# Altium project ControllerV3.0.PrjPcb
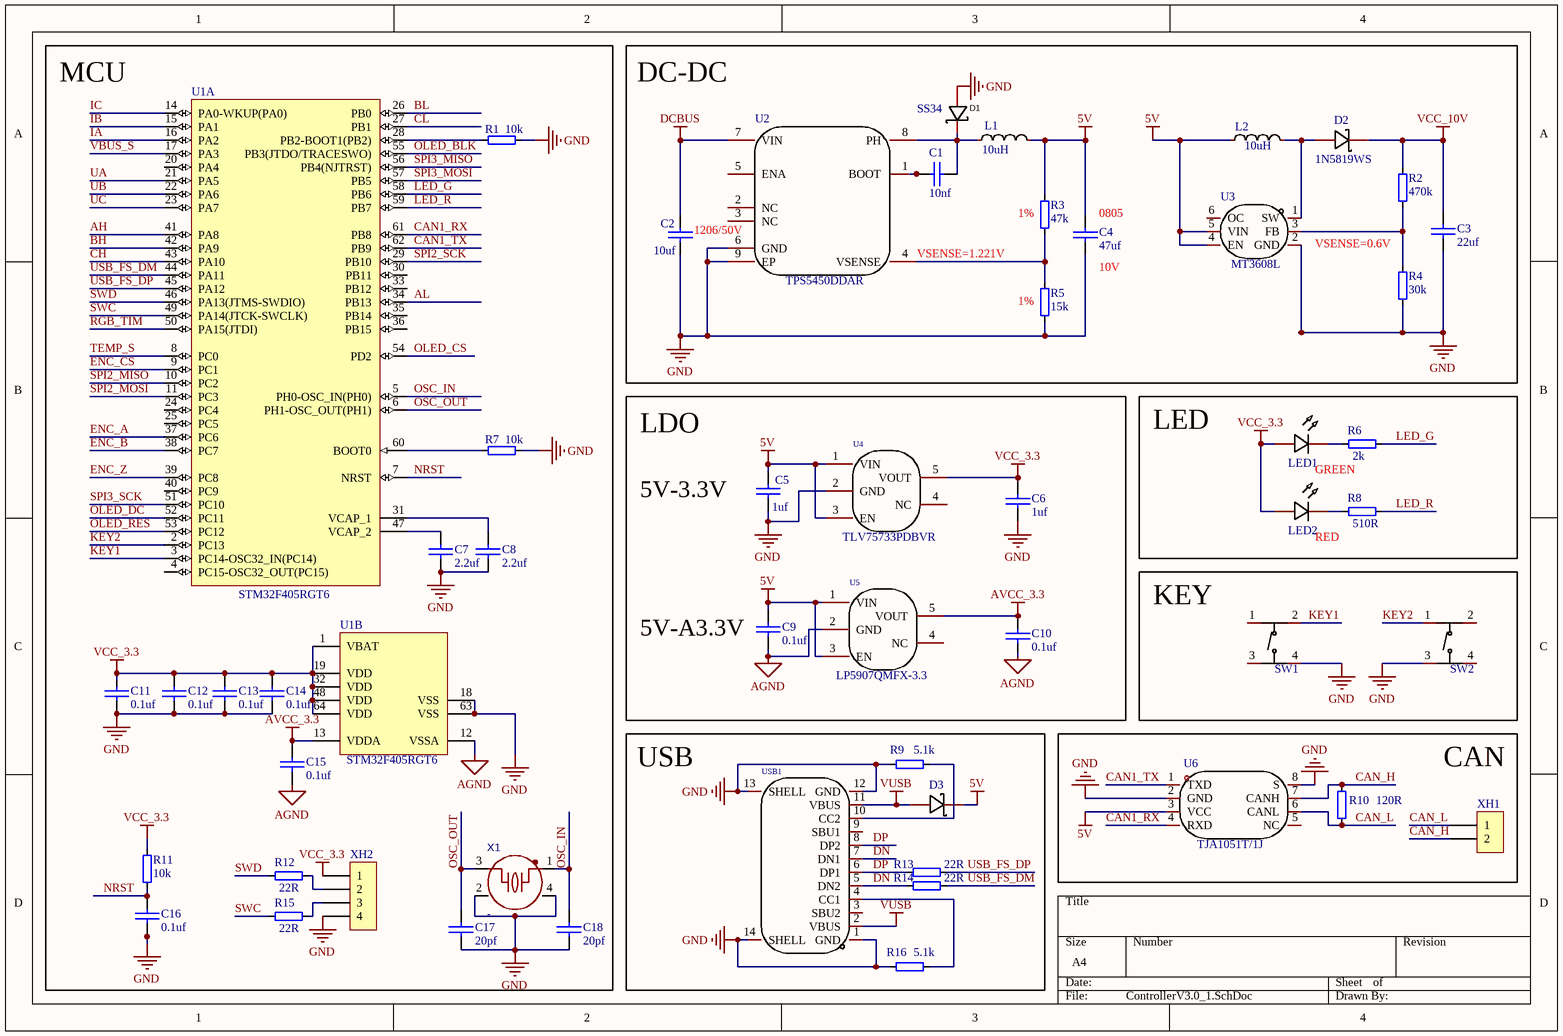
[diagram p0: ControllerV3.0_1.SchDoc]
2 sheets, 96 parts. Net scope: global (net labels, ports and power ports of the same name join across sheets).
Board file: ControllerV3.0.PcbDoc
Sheets:
  ControllerV3.0_1.SchDoc
  ControllerV3.0_2.SchDoc

## Sheet ControllerV3.0_1.SchDoc
size A4; SheetNumber: 1; SheetTotal: 2

### Parts
C1  10nf  [C0603_S]
C2  10uf  [C1206_S]
C3  22uf  [C0603_S]
C4  47uf  [C0805_S]
C5  1uf  [C0603_S]
C6  1uf  [C0603_S]
C7  2.2uf  [C0603_S]
C8  2.2uf  [C0603_S]
C9  0.1uf  [C0603_S]
C10  0.1uf  [C0603_S]
C11  0.1uf  [C0603_S]
C12  0.1uf  [C0603_S]
C13  0.1uf  [C0603_S]
C14  0.1uf  [C0603_S]
C15  0.1uf  [C0603_S]
C16  0.1uf  [C0603_S]
C17  20pf  [C0603_S]
C18  20pf  [C0603_S]
D1  SS34  [SS34]
D2  1N5819WS  [SOD-323]
D3  1N5819WS  [SOD-323]  (value not drawn)
L1  10uH  [SMD-0420]
L2  10uH  [IND-SMD_L3.0-W3.0_SWPA3010S]
LED1  LED_0603-B  [LED_0603]  (value not drawn)
LED2  LED_0603-B  [LED_0603]  (value not drawn)
R1  10k  [R0603_S]
R2  470k  [R0603_S]
R3  47k  [R0603_S]
R4  30k  [R0603_S]
R5  15k  [R0603_S]
R6  2k  [R0603_S]
R7  10k  [R0603_S]
R8  510R  [R0603_S]
R9  5.1k  [R0603_S]
R10  120R  [R0603_S]
R11  10k  [R0603_S]
R12  22R  [R0603_S]
R13  22R  [R0603_S]
R14  22R  [R0603_S]
R15  22R  [R0603_S]
R16  5.1k  [R0603_S]
SW1  TS-1187A-B-A-B  [TSW SMD-4*4*1.5]  (value not drawn)
SW2  TS-1187A-B-A-B  [TSW SMD-4*4*1.5]  (value not drawn)
U1  STM32F405RGT6  [LQFP_64]  (parts A,B of 2)
U2  TPS5450DDAR  [SOP-8-EP]
U3  MT3608L  [SOT-23-6]
U4  TLV75733PDBVR  [SOT-23-5]
U5  LP5907QMFX-3.3  [SOT-23-5]
U6  TJA1051T/1J  [SOP-8]
USB1  TYPE-C 16PIN 2MD(073)  [USB-C-SMD_TYPE-C-6PIN-2MD-073]  (value not drawn)
X1  -  [OSC 3225-4P]
XH1  XH2.54-WS-2P  [XH2.54-WS-2P]  (value not drawn)
XH2  GH1.25-WS-4P  [GH1.25-WS-4P]  (value not drawn)

### Blocks framed on the sheet
MCU: C7 C8 C11-C18 R1 R7 R11 R12 R15 U1 X1 XH2
DC-DC: C1-C4 D1 D2 L1 L2 R2-R5 U2 U3
LDO: C5 C6 C9 C10 U4 U5
LED: LED1 LED2 R6 R8
KEY: SW1 SW2
USB: D3 R9 R13 R14 R16 USB1
CAN: R10 U6 XH1

### Nets
5V: C4.1 C5.1 C9.1 D3.1(K) L1.2 L2.1 R3.2 U3.4(EN) U3.5(VIN) U4.1(VIN) U4.3(EN) U5.1(VIN) U5.3(EN) U6.3(VCC)
AGND: C9.2 C10.2 C15.2 U1.12(VSSA) U5.2(GND)
AVCC_3.3: C10.1 C15.1 U1.13(VDDA) U5.5(VOUT)
DCBUS: C2.1 U2.7(VIN)
GND: C2.2 C3.1 C4.2 C5.2 C6.2 C7.2 C8.2 C11.2 C12.2 C13.2 C14.2 C16.1 C17.2 C18.2 D1.2(A) R1.2 R4.1 R5.1 R7.2 R9.1 R16.1 SW1.4(D) SW2.3(C) U1.18(VSS) U1.63(VSS) U2.6(GND) U2.9(EP) U3.2(GND) U4.2(GND) U6.2(GND) U6.8(S) USB1.1(GND) USB1.12(GND) USB1.13(SHELL) USB1.14(SHELL) X1.2(GND) X1.4(GND) XH2.4
VCC_3.3: C6.1 C11.1 C12.1 C13.1 C14.1 LED1.2(A) LED2.2(A) R11.2 U1.1(VBAT) U1.19(VDD) U1.32(VDD) U1.48(VDD) U1.64(VDD) U4.5(VOUT) XH2.1
VCC_10V: C3.2 D2.1(K) R2.2
VUSB: D3.2(A) USB1.2(VBUS) USB1.11(VBUS)
AH: U1.41(PA8)
AL: U1.34(PB13)
BH: U1.42(PA9)
BL: U1.26(PB0)
CAN1_RX: U1.61(PB8) U6.4(RXD)
CAN1_TX: U1.62(PB9) U6.1(TXD)
CAN_H: R10.2 U6.7(CANH) XH1.2
CAN_L: R10.1 U6.6(CANL) XH1.1
CH: U1.43(PA10)
CL: U1.27(PB1)
DN: R14.1 USB1.5(DN2) USB1.7(DN1)
DP: R13.1 USB1.6(DP1) USB1.8(DP2)
ENC_A: U1.37(PC6)
ENC_B: U1.38(PC7)
ENC_CS: U1.9(PC1)
ENC_Z: U1.39(PC8)
IA: U1.16(PA2)
IB: U1.15(PA1)
IC: U1.14(PA0-WKUP(PA0))
KEY1: SW1.2(B) U1.3(PC14-OSC32_IN(PC14))
KEY2: SW2.1(A) U1.2(PC13)
LED_G: R6.2 U1.58(PB6)
LED_R: R8.2 U1.59(PB7)
NRST: C16.2 R11.1 U1.7(NRST)
OLED_BLK: U1.55(PB3(JTDO/TRACESWO))
OLED_CS: U1.54(PD2)
OLED_DC: U1.52(PC11)
OLED_RES: U1.53(PC12)
OSC_IN: C18.1 U1.5(PH0-OSC_IN(PH0)) X1.1
OSC_OUT: C17.1 U1.6(PH1-OSC_OUT(PH1)) X1.3
RGB_TIM: U1.50(PA15(JTDI))
SPI2_MISO: U1.10(PC2)
SPI2_MOSI: U1.11(PC3)
SPI2_SCK: U1.29(PB10)
SPI3_MISO: U1.56(PB4(NJTRST))
SPI3_MOSI: U1.57(PB5)
SPI3_SCK: U1.51(PC10)
SWC: R15.1 U1.49(PA14(JTCK-SWCLK))
SWD: R12.1 U1.46(PA13(JTMS-SWDIO))
TEMP_S: U1.8(PC0)
UA: U1.21(PA5)
UB: U1.22(PA6)
UC: U1.23(PA7)
USB_FS_DM: R14.2 U1.44(PA11)
USB_FS_DP: R13.2 U1.45(PA12)
VBUS_S: U1.17(PA3)
NetC1_1: C1.1 U2.1(BOOT)
NetC1_2: C1.2 D1.1(K) L1.1 U2.8(PH)
NetC7_1: C7.1 U1.47(VCAP_2)
NetC8_1: C8.1 U1.31(VCAP_1)
NetD2_2: D2.2(A) L2.2 U3.1(SW)
NetLED1_1: LED1.1(C) R6.1
NetLED2_1: LED2.1(C) R8.1
NetR1_1: R1.1 U1.28(PB2-BOOT1(PB2))
NetR2_1: R2.1 R4.2 U3.3(FB)
NetR3_1: R3.1 R5.2 U2.4(VSENSE)
NetR7_1: R7.1 U1.60(BOOT0)
NetR9_2: R9.2 USB1.10(CC2)
NetR12_2: R12.2 XH2.2
NetR15_2: R15.2 XH2.3
NetR16_2: R16.2 USB1.4(CC1)

Not connected (* = marked no-connect by the designer): SW1 1(A) 3(C); SW2 2(B) 4(D); U1 4(PC15-OSC32_OUT(PC15)) 20(PA4) 24(PC4) 25(PC5) 30(PB11) 33(PB12) 35(PB14) 36(PB15) 40(PC9); U2 2(NC) 3(NC) 5(ENA); U3 6(OC); U4 4(NC); U5 4(NC); U6 5(NC); USB1 3(SBU2) 9(SBU1)

### Notes on the sheet
- 1206/50V
- (near R3) 1%
- (near C4) 0805
- VSENSE=0.6V
- (near U2) VSENSE=1.221V
- (near R5) 1%
- (near C4) 10V
- (near C5) 5V-3.3V
- GREEN
- RED
- (near C9) 5V-A3.3V

### Library data of the parts
C1-C18 = CAP: 贴片电容
D1 = SS34: 肖特基二极管; Manufacturer: MDD; Symbol: SS34_C8678; Add into BOM: yes; Name: SS34; Device: SS34_C8678; LCSC Part Name: SS34; Supplier Part: C8678; Manufacturer Part: SS34; Supplier Footprint: SMA(DO-214AC); JLCPCB Part Class: Basic Part; Datasheet: https://atta.szlcsc.com/upload/public/pdf/source/20220408/D0396E57A6E83C6AFC0ED25EC9EDE030.pdf; Supplier: LCSC; Convert to PCB: yes
D2 D3 = 1N5819WS: 肖特基二极管; Manufacturer: Hottech(合科泰); Device: 1N5819WS_C191023; Add into BOM: yes; Forward Voltage (Vf@If): 600mV@1A; Reverse Voltage (Vr): 40V; Average Rectified Current (Io): 1A; Symbol: 1N5819WS; Supplier: LCSC; Supplier Part: C191023; Manufacturer Part: 1N5819WS; JLCPCB Part Class: 基础库; LCSC Part Name: 电压:40V 电流:1A; Supplier Footprint: SOD-323; Datasheet: https://atta.szlcsc.com/upload/public/pdf/source/20220428/3CB86FD8D28D653594B4E35F9D5AEFD9.pdf; Convert to PCB: yes
L1 = IND: 功率电感
L2 = SWPA3015S100MT: 电感值:10uH;精度:±20%;额定电流:920mA;; Manufacturer: SXN(顺翔诺); Symbol: SMDRI74-220M; Add into BOM: yes; Value: 22uH; Tolerance: ±20%; Rated Current: 1.23A; DC Resistance (DCR): 110mΩ; Device: SMDRI74-220M; LCSC Part Name: 22uH ±20% 1.23A 110mΩ; Supplier Part: C164083; Manufacturer Part: SMDRI74-220M; Supplier Footprint: SMD; JLCPCB Part Class: Extended Part; Datasheet: https://atta.szlcsc.com/upload/public/pdf/source/20210810/6F96FDC19AA308DD2AD166FFB9640E87.pdf; Supplier: LCSC; Convert to PCB: yes
LED1 LED2 = LED: Symbol: LED_B; Convert to PCB: yes; Device: LED_0603-B; Add into BOM: yes; Supplier Footprint: 0603
R1-R16 = RES: 贴片电阻
SW1 SW2 = TS-1187A-B-A-B: 轻触开关; Manufacturer: XKB Connectivity(中国星坤); Add into BOM: yes; Circuit: 单刀单掷; Actuator Style: 圆形按钮; Switch Length: 5.1mm; Switch Height: 1.5mm; Strike Gundam: 不带; Contact Current: 50mA; Voltage Rating (DC): 12V; Actuator/Cap Color: 金色; With Lamp: 无; Operating Force: 160gf; Mechanical Life: 10万次; Symbol: TS-1187A-B-A-B; Device: TS-1187A-B-A-B; Supplier: LCSC; Supplier Part: C318884; Manufacturer Part: TS-1187A-B-A-B; JLCPCB Part Class: 基础库; LCSC Part Name: 5.1*5.1*1.5mm 立贴 轻触开关; Supplier Footprint: SMD; Datasheet: https://atta.szlcsc.com/upload/public/pdf/source/20200227/C318890_053E50208A88A7BA1965D8746000774E.pdf; Convert to PCB: yes; Switch Width: 5.1mm; Mounting Style: 立贴; Insulation Resistance: -; Operating Temperature: -30℃~+85℃
U1 = STM32F405RGT6: ARM Cortex-M4 32-bit MCU+FPU, 210 DMIPS, 1024 kB Flash, 192 kB Internal RAM, 51 I/Os, 64-pin LQFP, -40 to 85 degC, Tray; Manufacturer: STMicroelectronics; D/A Converter: 2x12-bit; FLASH Size (Prog) (kB): 1024; I/Os (High Current): 51; Internal RAM Size (kB): 192; Operating Frequency(F) (Processor speed) (MHz): 168; Supply Voltage(Vcc) max (V): 3.6; Supply Voltage(Vcc) min (V): 1.8; DatasheetVersion: Rev. 4; PackageVersion: Rev. 4, 06/2013; PackageReference: LQFP64; PackageDescription: 64-Pin Low Profile Quad Flat Package, 10 x 10 mm Body, 0.5 mm Pitch; Supplier 1: Digi-Key; Supplier Part Number 1: 497-11767-ND; Supplier 2: Farnell; Supplier Part Number 2: 2064363; Supplier 3: Newark; Supplier Part Number 3: 73T2329; Supplier 4: Mouser; Supplier Part Number 4: 511-STM32F405RGT6; Core: ARM Cortex-M4; Packing: Tray; Mounting Technology: Surface Mount; PartNumber: STM32F405RGT6; ComponentLink1Description: Manufacturer URL; ComponentLink1URL: http://www.st.com/web/en/home.html; ComponentLink2Description: Datasheet; ComponentLink2URL: http://www.st.com/st-web-ui/static/active/en/resource/technical/document/datasheet/DM00037051.pdf; ComponentLink3Description: Package Specification; ComponentLink3URL: http://www.st.com/st-web-ui/static/active/en/resource/technical/document/datasheet/DM00037051.pdf
U2 = TPS5450DDAR: Manufacturer: TI(德州仪器); Add into BOM: yes; Function: 降压型; Input Voltage: 5.5V~36V; Output Voltage: 1.221V~31.32V; Output Current (Max): 5A; Switching Frequency: 500kHz; Output Type: 可调; Synchronous Rectification: 否; Number of Outputs: 1; Topology: 降压式; Symbol: TPS5450DDAR; Device: TPS5450DDAR; Supplier: LCSC; Manufacturer Part: TPS5450DDAR; Supplier Part: C114425; JLCPCB Part Class: 扩展库; LCSC Part Name: TPS5450DDAR; Supplier Footprint: SOP-8-EP-150mil; Datasheet: https://www.ti.com/cn/lit/gpn/tps5450; Convert to PCB: yes; Operating Temperature: -40℃~+125℃@(TJ)
U3 = MT3608L: Manufacturer: 西安航天民芯; Add into BOM: yes; Symbol: MT3608L; Device: MT3608L; LCSC Part Name: MT3608L; Supplier Part: C2932326; Manufacturer Part: MT3608L; Supplier Footprint: SOT-23-6; JLCPCB Part Class: 扩展库; Datasheet: https://atta.szlcsc.com/upload/public/pdf/source/20211213/953A62CC1033762E00AABAD4906DD7F1.pdf; Supplier: LCSC; Convert to PCB: yes
U4 = TLV75733PDBVR: Manufacturer: RICHTEK(立锜); Symbol: RT9013-33GB; Add into BOM: yes; Output Type: 固定; Output Polarity: 正; Number of Outputs: 1; Maximum Input Voltage: 5.5V; Output Voltage: 3.3V; Dropout Voltage: 400mV@(500mA); Quiescent Current (Ground Current): 50uA; Output Current: 500mA; Power Supply Rejection Ratio (PSRR): 50dB@(10kHz); Device: RT9013-33GB; LCSC Part Name: 输入5.5V 输出3.3V 500mA; Supplier Part: C47773; Manufacturer Part: RT9013-33GB; Supplier Footprint: SOT-23-5; JLCPCB Part Class: 扩展库; Datasheet: https://atta.szlcsc.com/upload/public/pdf/source/20150504/1457707282459.pdf; Supplier: LCSC; Convert to PCB: yes; Noise: -; Feature: -; Operating Temperature: -40℃~+85℃
U5 = LP5907QMFX-3.3: Manufacturer: RICHTEK(立锜); Symbol: RT9013-33GB; Add into BOM: yes; Output Type: 固定; Output Polarity: 正; Number of Outputs: 1; Maximum Input Voltage: 5.5V; Output Voltage: 3.3V; Dropout Voltage: 400mV@(500mA); Quiescent Current (Ground Current): 50uA; Output Current: 500mA; Power Supply Rejection Ratio (PSRR): 50dB@(10kHz); Device: RT9013-33GB; LCSC Part Name: 输入5.5V 输出3.3V 500mA; Supplier Part: C47773; Manufacturer Part: RT9013-33GB; Supplier Footprint: SOT-23-5; JLCPCB Part Class: 扩展库; Datasheet: https://atta.szlcsc.com/upload/public/pdf/source/20150504/1457707282459.pdf; Supplier: LCSC; Convert to PCB: yes; Noise: -; Feature: -; Operating Temperature: -40℃~+85℃
U6 = TJA1051T/1J: 类型:收发器;数据速率:5Mbps;; Manufacturer: NXP(恩智浦); Add into BOM: yes; Data Rate: 5Mbps; Supply Voltage: 4.5V~5.5V; Symbol: TJA1051T/1J; Device: TJA1051T/1J; LCSC Part Name: 5Mbps 4.5V~5.5V; Supplier Part: C92211; Manufacturer Part: TJA1051T/1J; Supplier Footprint: SOIC-8; JLCPCB Part Class: 扩展库; Datasheet: https://atta.szlcsc.com/upload/public/pdf/source/20170810/C124020_1502335225901879762.pdf; Supplier: LCSC; Convert to PCB: yes; Type: 收发器; Operating Temperature: -40℃~+150℃
USB1 = TYPE-C 16PIN 2MD(073): 连接器类型:Type-C;标准:-;公母:母座;触点数量:16;端口数量:1;安装方式:卧贴;额定电流 - 电源:5A;工作温度范围:-25℃~+85℃;; Manufacturer: SHOU HAN(首韩); Add into BOM: yes; Gender: 母座; Number of Contacts: 16; Number of Ports: 1; Current Rating - Power (Max): 5A; Symbol: TYPE-C 16PIN 2MD(073); Device: TYPE-C 16PIN 2MD(073); LCSC Part Name: TYPE-C母座 16P 4脚插件带定位柱 不锈钢外壳 2次模顶; Supplier Part: C2765186; Manufacturer Part: TYPE-C 16PIN 2MD(073); Supplier Footprint: SMD; JLCPCB Part Class: 扩展库; Supplier: LCSC; Convert to PCB: yes; Connector Type: Type-C; Standard: -; Mounting Style: 卧贴; Operating Temperature Range: -25℃~+85℃
X1 = 四脚无源晶振: 8MHz; BOM_Manufacturer: NDK; BOM_Manufacturer Part: NX2016SA-32MHZ-STD-CZS-5; Contributor: LCSC; nameAlias: Frequency; BOM_Supplier: LCSC; BOM_Supplier Part: C843260; BOM_JLCPCB Part Class: Extended Part; spicePre: X; spiceSymbolName: NX2016SA-32MHZ-STD-CZS-5

## Sheet ControllerV3.0_2.SchDoc
size A; SheetNumber: 2; SheetTotal: 2
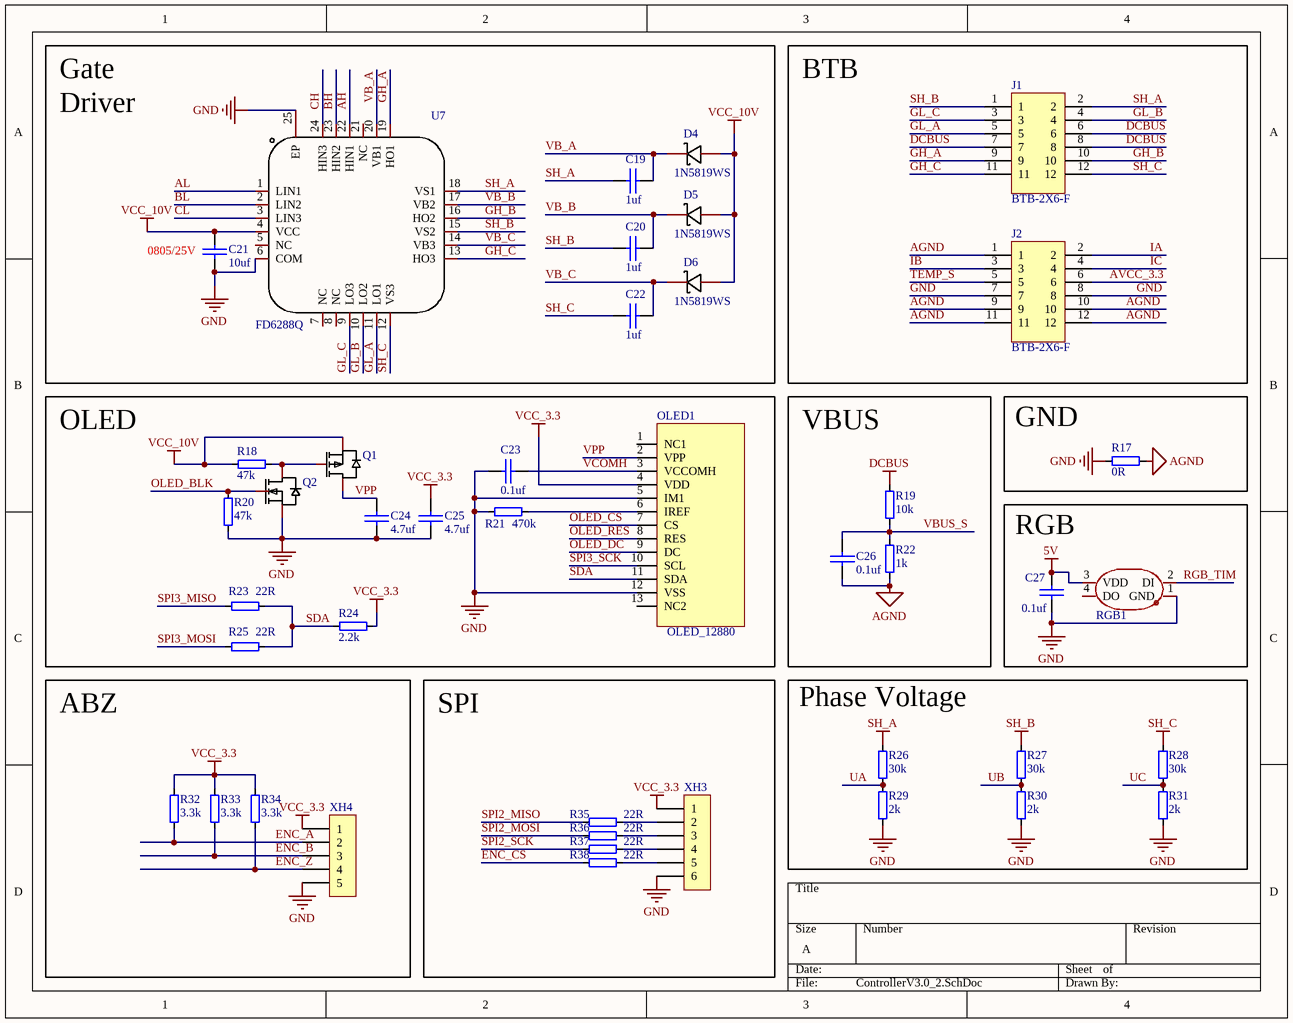
[diagram p1: ControllerV3.0_2.SchDoc]

### Parts
C19  1uf  [C0603_S]
C20  1uf  [C0603_S]
C21  10uf  [C0805_S]
C22  1uf  [C0603_S]
C23  0.1uf  [C0603_S]
C24  4.7uf  [C0603_S]
C25  4.7uf  [C0603_S]
C26  0.1uf  [C0603_S]
C27  0.1uf  [C0603_S]
D4  1N5819WS  [SOD-323]
D5  1N5819WS  [SOD-323]
D6  1N5819WS  [SOD-323]
J1  BTB-2X6-F  [BTB-F-0.8mm-2x6P]
J2  BTB-2X6-F  [BTB-F-0.8mm-2x6P]
OLED1  OLED_12880  [OLED_12880]
Q1  FDN338P  [SOT-23-3]  (value not drawn)
Q2  FDN335N  [SOT-23-3]  (value not drawn)
R17  0R  [R0603_S]
R18  47k  [R0603_S]
R19  10k  [R0603_S]
R20  47k  [R0603_S]
R21  470k  [R0603_S]
R22  1k  [R0603_S]
R23  22R  [R0603_S]
R24  2.2k  [R0603_S]
R25  22R  [R0603_S]
R26  30k  [R0603_S]
R27  30k  [R0603_S]
R28  30k  [R0603_S]
R29  2k  [R0603_S]
R30  2k  [R0603_S]
R31  2k  [R0603_S]
R32  3.3k  [R0603_S]
R33  3.3k  [R0603_S]
R34  3.3k  [R0603_S]
R35  22R  [R0603_S]
R36  22R  [R0603_S]
R37  22R  [R0603_S]
R38  22R  [R0603_S]
RGB1  XL-3528RGBW-WS2812B  [LED-SMD_4P]  (value not drawn)
U7  FD6288Q  [QFN-24-EP(4x4)]
XH3  XH2.54-WS-6P  [XH2.54-WS-6P]  (value not drawn)
XH4  XH2.54-WS-5P  [XH2.54-WS-5P]  (value not drawn)

### Blocks framed on the sheet
BTB: J1 J2
OLED: C23-C25 OLED1 Q1 Q2 R18 R20 R21 R23-R25
VBUS: C26 R19 R22
GND: R17
RGB: C27 RGB1
ABZ: R32-R34 XH4
SPI: R35-R38 XH3
Phase Voltage: R26-R31

### Nets
5V: C27.1 RGB1.3(VDD)
AGND: C26.2 J2.1 J2.9 J2.10 J2.11 J2.12 R17.1 R22.1
AVCC_3.3: J2.6
DCBUS: J1.6 J1.7 J1.8 R19.2
GND: C21.2 C23.1 C24.1 C25.1 C27.2 J2.7 J2.8 OLED1.5(IM1) OLED1.12(VSS) Q2.2(S) R17.2 R20.1 R21.1 R29.1 R30.1 R31.1 RGB1.1(GND) U7.6(COM) U7.25(EP) XH3.6 XH4.5
SH_A: C19.1 J1.2 R26.2 U7.18(VS1)
SH_B: C20.1 J1.1 R27.2 U7.15(VS2)
SH_C: C22.1 J1.12 R28.2 U7.12(VS3)
VCC_3.3: C25.2 OLED1.4(VDD) R24.1 R32.2 R33.2 R34.2 XH3.1 XH4.1
VCC_10V: C21.1 D4.2(A) D5.2(A) D6.2(A) Q1.2(S) R18.2 U7.4(VCC)
AH: U7.22(HIN1)
AL: U7.1(LIN1)
BH: U7.23(HIN2)
BL: U7.2(LIN2)
CH: U7.24(HIN3)
CL: U7.3(LIN3)
ENC_A: R32.1 XH4.2
ENC_B: R33.1 XH4.3
ENC_CS: R38.1
ENC_Z: R34.1 XH4.4
GH_A: J1.9 U7.19(HO1)
GH_B: J1.10 U7.16(HO2)
GH_C: J1.11 U7.13(HO3)
GL_A: J1.5 U7.11(LO1)
GL_B: J1.4 U7.10(LO2)
GL_C: J1.3 U7.9(LO3)
IA: J2.2
IB: J2.3
IC: J2.4
OLED_BLK: Q2.1(G) R20.2
OLED_CS: OLED1.7(CS)
OLED_DC: OLED1.9(DC)
OLED_RES: OLED1.8(RES)
RGB_TIM: RGB1.2(DI)
SDA: OLED1.11(SDA) R23.2 R24.2 R25.2
SPI2_MISO: R35.1
SPI2_MOSI: R36.1
SPI2_SCK: R37.1
SPI3_MISO: R23.1
SPI3_MOSI: R25.1
SPI3_SCK: OLED1.10(SCL)
TEMP_S: J2.5
UA: R26.1 R29.2
UB: R27.1 R30.2
UC: R28.1 R31.2
VB_A: C19.2 D4.1(K) U7.20(VB1)
VB_B: C20.2 D5.1(K) U7.17(VB2)
VB_C: C22.2 D6.1(K) U7.14(VB3)
VBUS_S: C26.1 R19.1 R22.2
VCOMH: C23.2 OLED1.3(VCCOMH)
VPP: C24.2 OLED1.2(VPP) Q1.3(D)
NetOLED1_6: OLED1.6(IREF) R21.2
NetQ1_1: Q1.1(G) Q2.3(D) R18.1
NetR35_2: R35.2 XH3.2
NetR36_2: R36.2 XH3.3
NetR37_2: R37.2 XH3.4
NetR38_2: R38.2 XH3.5

Not connected (* = marked no-connect by the designer): OLED1 1(NC1) 13(NC2); RGB1 4(DO); U7 5(NC) 7(NC) 8(NC) 21(NC)

### Notes on the sheet
- Gate
- Driver
- (near C21) 0805/25V

### Library data of the parts
C19-C27 = CAP: 贴片电容
D4-D6 = 1N5819WS: as D2 on sheet ControllerV3.0_1; Symbol: 1N5819WS; Supplier: LCSC; Supplier Part: C191023; Manufacturer Part: 1N5819WS; JLCPCB Part Class: 基础库; LCSC Part Name: 电压:40V 电流:1A; Supplier Footprint: SOD-323; Datasheet: https://atta.szlcsc.com/upload/public/pdf/source/20220428/3CB86FD8D28D653594B4E35F9D5AEFD9.pdf; Convert to PCB: yes
J1 J2 = BTB-2X6-F: 0.8间距2x6P母座
OLED1 = OLED_12880: OLED_128*80
Q1 = FDN338P: P沟道 耐压:20V 电流:2A; Manufacturer: TECH PUBLIC(台舟); Symbol: FDN338P_C2890130; Add into BOM: yes; Device: FDN338P; LCSC Part Name: FDN338P; Supplier Part: C2890130; Manufacturer Part: FDN338P; Supplier Footprint: SOT-23; JLCPCB Part Class: 扩展库; Datasheet: https://atta.szlcsc.com/upload/public/pdf/source/20210903/7E6CB84F0F80073F6978D1021964D836.pdf; Supplier: LCSC; Convert to PCB: yes
Q2 = FDN335N: N沟道 耐压:20V 电流:1.7A; Manufacturer: TECH PUBLIC(台舟); Symbol: FDN335N_C5123904; Add into BOM: yes; Device: FDN335N_C5123904; Supplier: LCSC; Supplier Part: C5123904; Manufacturer Part: FDN335N; JLCPCB Part Class: 扩展库; LCSC Part Name: FDN335N; Supplier Footprint: SOT-23(TO-236); Datasheet: https://atta.szlcsc.com/upload/public/pdf/source/20221011/C6D62871DD587F26C6CC0F7FCE0BC659.pdf; Convert to PCB: yes
R17-R38 = RES: 贴片电阻
RGB1 = XL-3528RGBW-WS2812B: 发光颜色:RGB三色; Manufacturer: XINGLIGHT(成兴光); Add into BOM: yes; Emitted Color: RGB三色; Dominant Wavelength: 618nm~623nm；520nm~525nm；467nm~472nm; Peak Wavelength: 525nm；623nm；472nm; Forward Current: 20mA; Power Dissipation: 50mW；50mW；45mW; Viewing Angle: 120°; Mounting Sytle: 正贴; Symbol: XL-3528RGBW-WS2812B; Device: XL-3528RGBW-WS2812B; LCSC Part Name: RGB三色 正贴 幻彩; Supplier Part: C2890364; Manufacturer Part: XL-3528RGBW-WS2812B; Supplier Footprint: SMD3528-4P; JLCPCB Part Class: 扩展库; Datasheet: https://atta.szlcsc.com/upload/public/pdf/source/20221102/50F456983F591359B0D81AA557777463.pdf; Supplier: LCSC; Convert to PCB: yes; Diode Configuration: -; Operating Temperature: -25℃~+80℃
U7 = FD6288Q: Manufacturer: Fortior Tech(峰岹); Symbol: FD6288Q_C328453; Add into BOM: yes; Device: FD6288Q; Supplier: LCSC; Supplier Part: C328453; Manufacturer Part: FD6288Q; JLCPCB Part Class: Extended Part; LCSC Part Name: FD6288Q; Supplier Footprint: QFN-24-EP(4x4); Datasheet: https://atta.szlcsc.com/upload/public/pdf/source/20181108/C328453_785547738DB9FC0123219FC22539EFAD.pdf; Convert to PCB: yes

## Nets that join several sheets
5V: ControllerV3.0_1 (14 pins), ControllerV3.0_2 (C27.1 RGB1.3)
AGND: ControllerV3.0_1 (5 pins), ControllerV3.0_2 (8 pins)
AVCC_3.3: ControllerV3.0_1 (C10.1 C15.1 U1.13 U5.5), ControllerV3.0_2 (J2.6)
DCBUS: ControllerV3.0_1 (C2.1 U2.7), ControllerV3.0_2 (J1.6 J1.7 J1.8 R19.2)
GND: ControllerV3.0_1 (38 pins), ControllerV3.0_2 (21 pins)
VCC_3.3: ControllerV3.0_1 (15 pins), ControllerV3.0_2 (8 pins)
VCC_10V: ControllerV3.0_1 (C3.2 D2.1 R2.2), ControllerV3.0_2 (7 pins)
AH: ControllerV3.0_1 (U1.41), ControllerV3.0_2 (U7.22)
AL: ControllerV3.0_1 (U1.34), ControllerV3.0_2 (U7.1)
BH: ControllerV3.0_1 (U1.42), ControllerV3.0_2 (U7.23)
BL: ControllerV3.0_1 (U1.26), ControllerV3.0_2 (U7.2)
CH: ControllerV3.0_1 (U1.43), ControllerV3.0_2 (U7.24)
CL: ControllerV3.0_1 (U1.27), ControllerV3.0_2 (U7.3)
ENC_A: ControllerV3.0_1 (U1.37), ControllerV3.0_2 (R32.1 XH4.2)
ENC_B: ControllerV3.0_1 (U1.38), ControllerV3.0_2 (R33.1 XH4.3)
ENC_CS: ControllerV3.0_1 (U1.9), ControllerV3.0_2 (R38.1)
ENC_Z: ControllerV3.0_1 (U1.39), ControllerV3.0_2 (R34.1 XH4.4)
IA: ControllerV3.0_1 (U1.16), ControllerV3.0_2 (J2.2)
IB: ControllerV3.0_1 (U1.15), ControllerV3.0_2 (J2.3)
IC: ControllerV3.0_1 (U1.14), ControllerV3.0_2 (J2.4)
OLED_BLK: ControllerV3.0_1 (U1.55), ControllerV3.0_2 (Q2.1 R20.2)
OLED_CS: ControllerV3.0_1 (U1.54), ControllerV3.0_2 (OLED1.7)
OLED_DC: ControllerV3.0_1 (U1.52), ControllerV3.0_2 (OLED1.9)
OLED_RES: ControllerV3.0_1 (U1.53), ControllerV3.0_2 (OLED1.8)
RGB_TIM: ControllerV3.0_1 (U1.50), ControllerV3.0_2 (RGB1.2)
SPI2_MISO: ControllerV3.0_1 (U1.10), ControllerV3.0_2 (R35.1)
SPI2_MOSI: ControllerV3.0_1 (U1.11), ControllerV3.0_2 (R36.1)
SPI2_SCK: ControllerV3.0_1 (U1.29), ControllerV3.0_2 (R37.1)
SPI3_MISO: ControllerV3.0_1 (U1.56), ControllerV3.0_2 (R23.1)
SPI3_MOSI: ControllerV3.0_1 (U1.57), ControllerV3.0_2 (R25.1)
SPI3_SCK: ControllerV3.0_1 (U1.51), ControllerV3.0_2 (OLED1.10)
TEMP_S: ControllerV3.0_1 (U1.8), ControllerV3.0_2 (J2.5)
UA: ControllerV3.0_1 (U1.21), ControllerV3.0_2 (R26.1 R29.2)
UB: ControllerV3.0_1 (U1.22), ControllerV3.0_2 (R27.1 R30.2)
UC: ControllerV3.0_1 (U1.23), ControllerV3.0_2 (R28.1 R31.2)
VBUS_S: ControllerV3.0_1 (U1.17), ControllerV3.0_2 (C26.1 R19.1 R22.2)